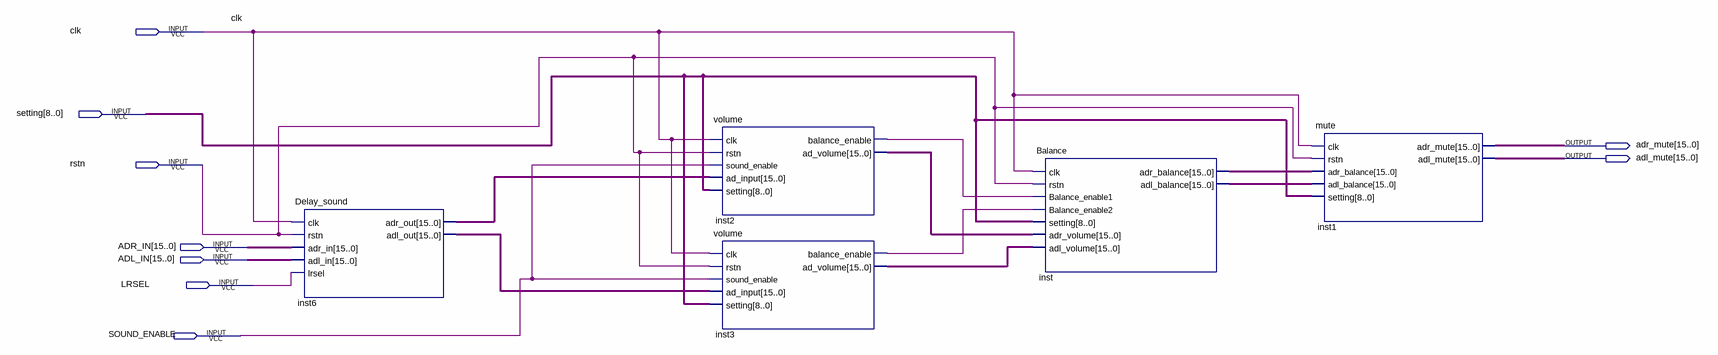
[diagram p0: schematic sheet]
// Quartus schematic sound_app.bdf as structural Verilog: 5 symbols, 9 pins
module sound_app (
  input  clk,
  input  [8:0] setting,
  input  rstn,
  input  [15:0] ADR_IN,
  input  [15:0] ADL_IN,
  input  LRSEL,
  input  SOUND_ENABLE,
  output [15:0] adr_mute,
  output [15:0] adl_mute
);

  wire inst2_balance_enable, inst3_balance_enable;
  wire [15:0] inst2_ad_volume, inst3_ad_volume, inst6_adl_out, inst6_adr_out, inst_adl_balance,
       inst_adr_balance;

  Delay_sound inst6 (
    .clk(clk), .rstn(rstn), .adr_in(ADR_IN), .adl_in(ADL_IN), .lrsel(LRSEL), .adr_out(inst6_adr_out),
    .adl_out(inst6_adl_out));
  volume inst2 (
    .clk(clk), .rstn(rstn), .sound_enable(SOUND_ENABLE), .ad_input(inst6_adr_out), .setting(setting),
    .balance_enable(inst2_balance_enable), .ad_volume(inst2_ad_volume));
  volume inst3 (
    .clk(clk), .rstn(rstn), .sound_enable(SOUND_ENABLE), .ad_input(inst6_adl_out), .setting(setting),
    .balance_enable(inst3_balance_enable), .ad_volume(inst3_ad_volume));
  Balance inst (
    .clk(clk), .rstn(rstn), .Balance_enable1(inst2_balance_enable), .Balance_enable2(inst3_balance_enable),
    .setting(setting), .adr_volume(inst2_ad_volume), .adl_volume(inst3_ad_volume),
    .adr_balance(inst_adr_balance), .adl_balance(inst_adl_balance));
  mute inst1 (
    .clk(clk), .rstn(rstn), .adr_balance(inst_adr_balance), .adl_balance(inst_adl_balance),
    .setting(setting), .adr_mute(adr_mute), .adl_mute(adl_mute));
endmodule
